# Altium schematic sheet Sheet1.SchDoc
size 558 x 330 mm
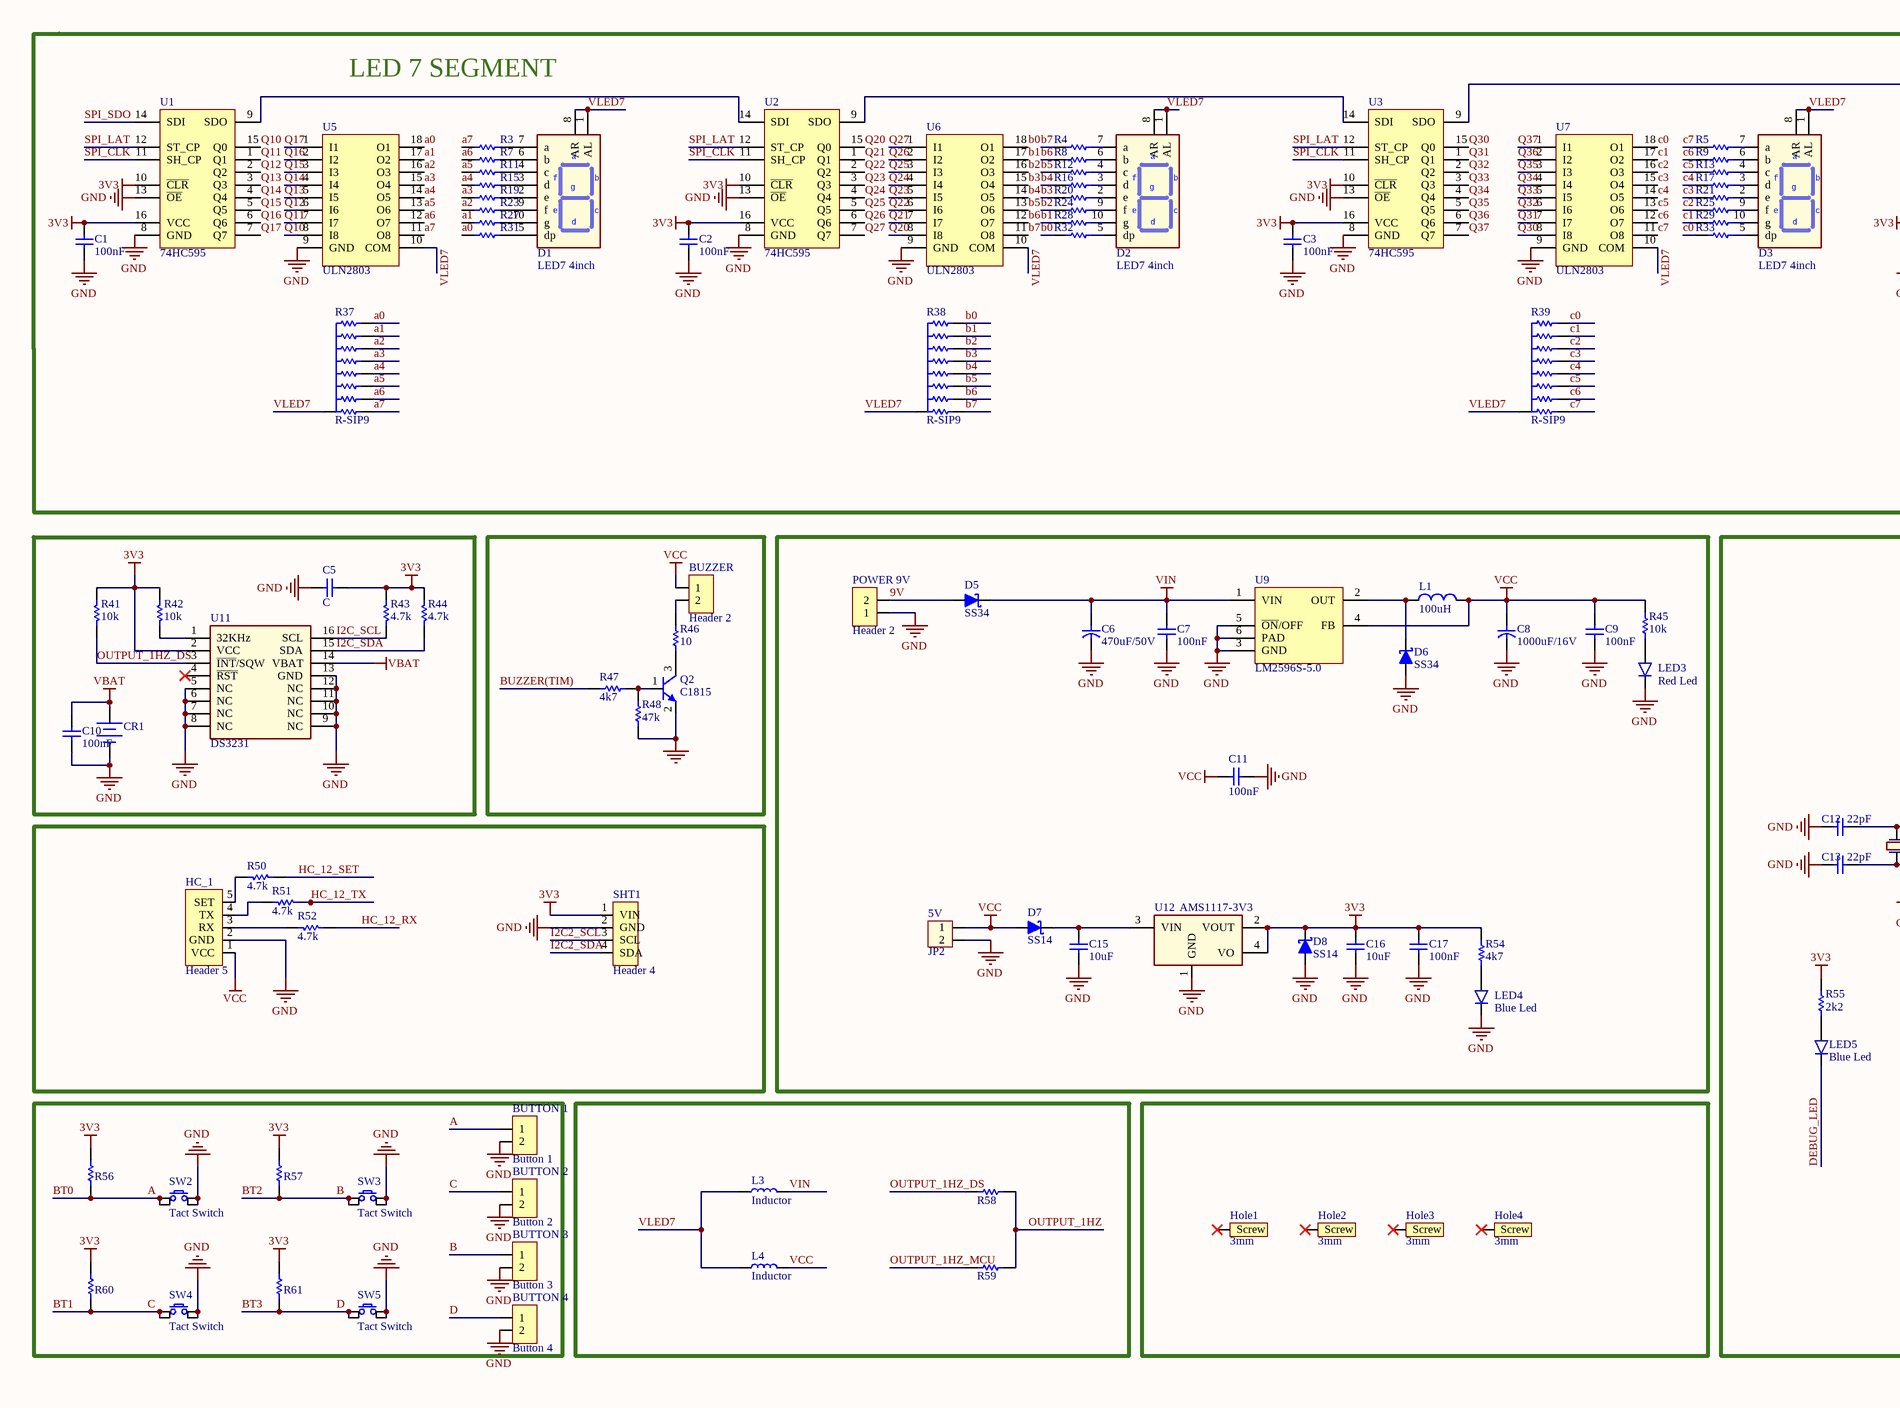
[diagram p0: Sheet1.SchDoc, left]
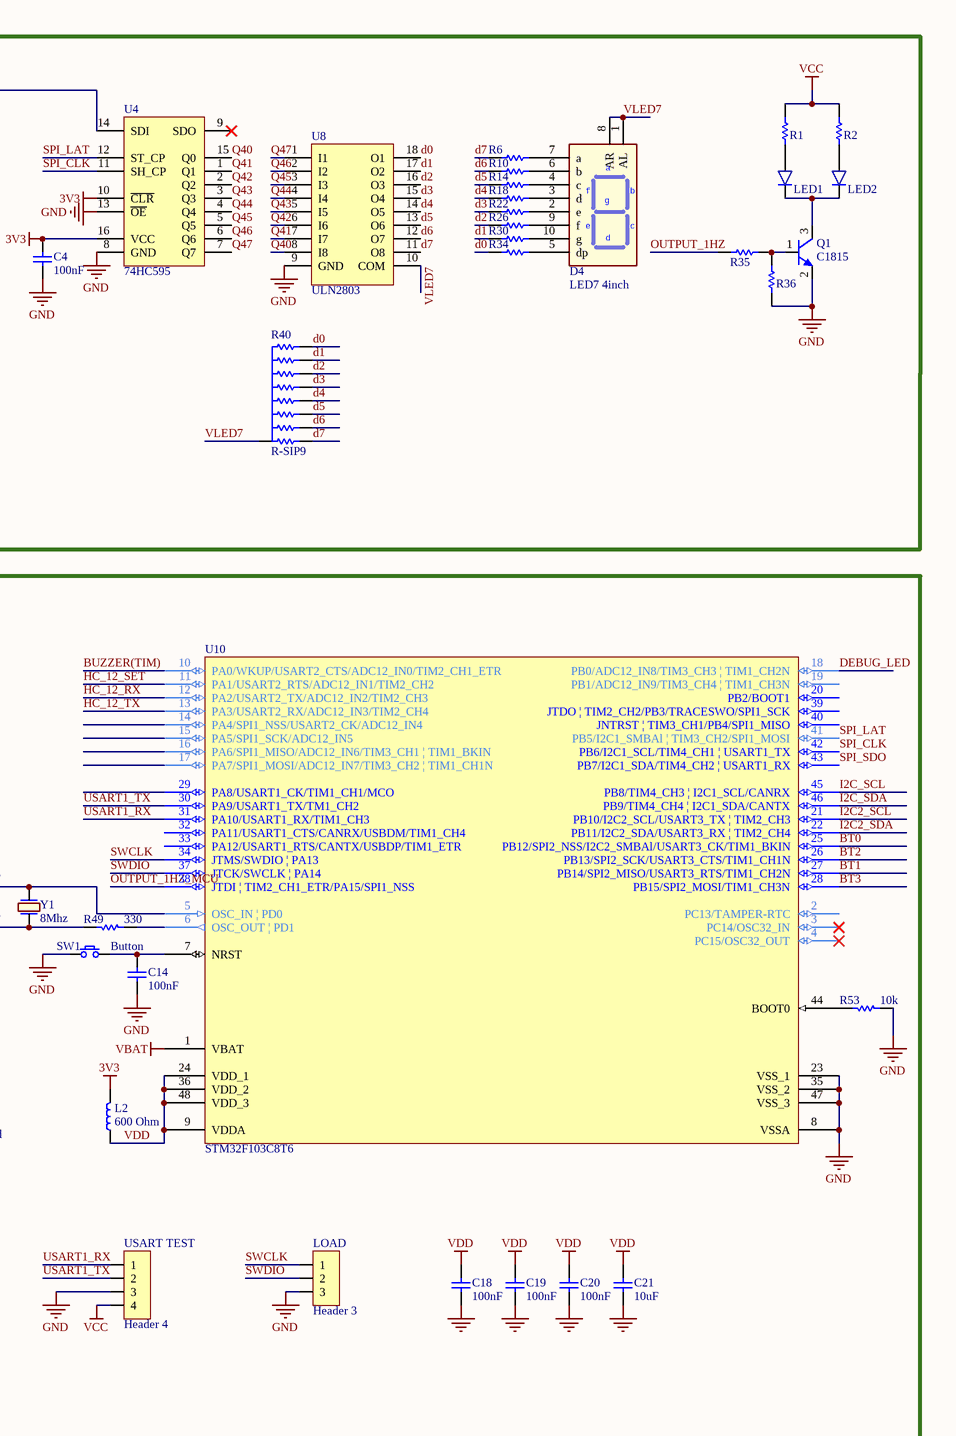
[diagram p1: Sheet1.SchDoc, right]

## Parts
5V  JP2  [CON Header 2]
BUTTON_1  Button 1  [CON Header 2]
BUTTON_2  Button 2  [CON Header 2]
BUTTON_3  Button 3  [CON Header 2]
BUTTON_4  Button 4  [CON Header 2]
BUZZER  Header 2  [CON Header 2]
C1  100nF  [C 0805 (2012)]
C2  100nF  [C 0805 (2012)]
C3  100nF  [C 0805 (2012)]
C4  100nF  [C 0805 (2012)]
C5  C  [C 0805 (2012)]
C6  470uF/50V  [CR/D.10.0x16.0/P.5.0]
C7  100nF  [C 0805 (2012)]
C8  1000uF/16V  [CR/D.10.0x12.5/P.5.0]
C9  100nF  [C 0805 (2012)]
C10  100nF  [C 0805 (2012)]
C11  100nF  [C 0805 (2012)]
C12  22pF  [C 0805 (2012)]
C13  22pF  [C 0805 (2012)]
C14  100nF  [C 0805 (2012)]
C15  10uF  [C 0805 (2012)]
C16  10uF  [C 0805 (2012)]
C17  100nF  [C 0805 (2012)]
C18  100nF  [C 0805 (2012)]
C19  100nF  [C 0805 (2012)]
C20  100nF  [C 0805 (2012)]
C21  10uF  [C 0805 (2012)]
CR1  (no value)  [CON CR1220]
D1  LED7 4inch  [LED7 4444]
D2  LED7 4inch  [LED7 4444]
D3  LED7 4inch  [LED7 4444]
D4  LED7 4inch  [LED7 4444]
D5  SS34  [DO-214AC (SMA)]
D6  SS34  [DO-214AC (SMA)]
D7  SS14  [DO-214AC (SMA)]
D8  SS14  [DO-214AC (SMA)]
HC_1  Header 5  [HC_12]
Hole1  3mm  [SCREW/3M/7M]
Hole2  3mm  [SCREW/3M/7M]
Hole3  3mm  [SCREW/3M/7M]
Hole4  3mm  [SCREW/3M/7M]
L1  100uH  [Inductor SMD 12x12x8]
L2  600 Ohm  [Inductor SMD 0805 (2012)]
L3  Inductor  [Inductor SMD 7.5x7.0x5.0]
L4  Inductor  [Inductor SMD 7.5x7.0x5.0]
LED1  Led  [LED 5MM]  (value not drawn)
LED2  Led  [LED 5MM]  (value not drawn)
LED3  Red Led  [Led SMD 0805]
LED4  Blue Led  [Led SMD 0805]
LED5  Blue Led  [Led SMD 0805]
LOAD  Header 3  [Header 3]
POWER_9V  Header 2  [CON Header 2]
Q1  C1815  [SOT-23]
Q2  C1815  [SOT-23]
R1  100Ohm  [R 0805 (2012)]  (value not drawn)
R2  100Ohm  [R 0805 (2012)]  (value not drawn)
R3  100Ohm  [R 0805 (2012)]  (value not drawn)
R4  100Ohm  [R 0805 (2012)]  (value not drawn)
R5  100Ohm  [R 0805 (2012)]  (value not drawn)
R6  100Ohm  [R 0805 (2012)]  (value not drawn)
R7  100Ohm  [R 0805 (2012)]  (value not drawn)
R8  100Ohm  [R 0805 (2012)]  (value not drawn)
R9  100Ohm  [R 0805 (2012)]  (value not drawn)
R10  100Ohm  [R 0805 (2012)]  (value not drawn)
R11  100Ohm  [R 0805 (2012)]  (value not drawn)
R12  100Ohm  [R 0805 (2012)]  (value not drawn)
R13  100Ohm  [R 0805 (2012)]  (value not drawn)
R14  100Ohm  [R 0805 (2012)]  (value not drawn)
R15  100Ohm  [R 0805 (2012)]  (value not drawn)
R16  100Ohm  [R 0805 (2012)]  (value not drawn)
R17  100Ohm  [R 0805 (2012)]  (value not drawn)
R18  100Ohm  [R 0805 (2012)]  (value not drawn)
R19  100Ohm  [R 0805 (2012)]  (value not drawn)
R20  100Ohm  [R 0805 (2012)]  (value not drawn)
R21  100Ohm  [R 0805 (2012)]  (value not drawn)
R22  100Ohm  [R 0805 (2012)]  (value not drawn)
R23  100Ohm  [R 0805 (2012)]  (value not drawn)
R24  100Ohm  [R 0805 (2012)]  (value not drawn)
R25  100Ohm  [R 0805 (2012)]  (value not drawn)
R26  100Ohm  [R 0805 (2012)]  (value not drawn)
R27  100Ohm  [R 0805 (2012)]  (value not drawn)
R28  100Ohm  [R 0805 (2012)]  (value not drawn)
R29  100Ohm  [R 0805 (2012)]  (value not drawn)
R30  100Ohm  [R 0805 (2012)]  (value not drawn)
R31  100Ohm  [R 0805 (2012)]  (value not drawn)
R32  100Ohm  [R 0805 (2012)]  (value not drawn)
R33  100Ohm  [R 0805 (2012)]  (value not drawn)
R34  100Ohm  [R 0805 (2012)]  (value not drawn)
R35  100Ohm  [R 0805 (2012)]  (value not drawn)
R36  100Ohm  [R 0805 (2012)]  (value not drawn)
R37  R-SIP9  [R SIP9]
R38  R-SIP9  [R SIP9]
R39  R-SIP9  [R SIP9]
R40  R-SIP9  [R SIP9]
R41  10k  [R 0805 (2012)]
R42  10k  [R 0805 (2012)]
R43  4.7k  [R 0805 (2012)]
R44  4.7k  [R 0805 (2012)]
R45  10k  [R 0805 (2012)]
R46  10  [R 0805 (2012)]
R47  4k7  [R 0805 (2012)]
R48  47k  [R 0805 (2012)]
R49  330  [R 0805 (2012)]
R50  4.7k  [R 0805 (2012)]
R51  4.7k  [R 0805 (2012)]
R52  4.7k  [R 0805 (2012)]
R53  10k  [R 0805 (2012)]
R54  4k7  [R 0805 (2012)]
R55  2k2  [R 0805 (2012)]
R56  100Ohm  [R 0805 (2012)]  (value not drawn)
R57  100Ohm  [R 0805 (2012)]  (value not drawn)
R58  100Ohm  [R 0805 (2012)]  (value not drawn)
R59  100Ohm  [R 0805 (2012)]  (value not drawn)
R60  100Ohm  [R 0805 (2012)]  (value not drawn)
R61  100Ohm  [R 0805 (2012)]  (value not drawn)
SHT1  Header 4  [CON Header 4]
SW1  Button  [SW/2/SMD]
SW2  Tact Switch  [SW/4/SMD/SMALL]
SW3  Tact Switch  [SW/4/SMD/SMALL]
SW4  Tact Switch  [SW/4/SMD/SMALL]
SW5  Tact Switch  [SW/4/SMD/SMALL]
U1  74HC595  [SOIC-16]
U2  74HC595  [SOIC-16]
U3  74HC595  [SOIC-16]
U4  74HC595  [SOIC-16]
U5  ULN2803  [SOIC-18]
U6  ULN2803  [SOIC-18]
U7  ULN2803  [SOIC-18]
U8  ULN2803  [SOIC-18]
U9  LM2596S-5.0  [TO-263-5]
U10  STM32F103C8T6  [LQFP48_N]
U11  DS3231  [SOIC-16-WIDE]
U12  AMS1117-3V3  [SOT-223]
USART_TEST  Header 4  [CON Header 4]
Y1  8Mhz  [Crystal HC49US SMD]

## Blocks framed on the sheet
LED 7 SEGMENT: C1-C4 D1-D4 LED1 LED2 Q1 R1-R40 U1-U8

## Nets
3V3: C1.1 C2.1 C3.1 C4.1 C5.2 C16.1 C17.1 D8.2(K) L2.2 R41.1 R42.1 R43.1 R44.1 R54.2 R55.2 R56.2 R57.2 R60.2 R61.2 SHT1.1(VIN) U1.10(~{CLR}) U1.16(VCC) U2.10(~{CLR}) U2.16(VCC) U3.10(~{CLR}) U3.16(VCC) U4.10(~{CLR}) U4.16(VCC) U11.2(VCC) U12.2(VOUT) U12.4(VO)
GND: 5V.2 BUTTON_1.2 BUTTON_2.2 BUTTON_3.2 BUTTON_4.2 C1.2 C2.2 C3.2 C4.2 C5.1 C6.2 C7.2 C8.2 C9.2 C10.2 C11.1 C12.2 C13.2 C14.2 C15.2 C16.2 C17.2 C18.2 C19.2 C20.2 C21.2 CR1.2(GND) D6.1(A) D8.1(A) HC_1.2(GND) LED3.2(K) LED4.2(K) LOAD.3 POWER_9V.1 Q1.2(E) Q2.2(E) R36.1 R48.2 R53.1 SHT1.2(GND) SW1.1 SW2.2 SW2.3 SW3.2 SW3.3 SW4.2 SW4.3 SW5.2 SW5.3 U1.8(GND) U1.13(~{OE}) U2.8(GND) U2.13(~{OE}) U3.8(GND) U3.13(~{OE}) U4.8(GND) U4.13(~{OE}) U5.9(GND) U6.9(GND) U7.9(GND) U8.9(GND) U9.3(GND) U9.5(~{ON}/OFF) U9.6(GND) U10.8(VSSA) U10.23(VSS_1) U10.35(VSS_2) U10.47(VSS_3) U11.5(NC) U11.6(NC) U11.7(NC) U11.8(NC) U11.9(NC) U11.10(NC) U11.11(NC) U11.12(NC) U11.13(GND) U12.1(GND) USART_TEST.3
VBAT: C10.1 CR1.1(VCC) U10.1(VBAT) U11.14(VBAT)
VCC: 5V.1 BUZZER.1 C8.1 C9.1 C11.2 D7.1(A) HC_1.1(VCC) L1.2 L4.2 R1.1 R2.1 R45.2 U9.4(FB) USART_TEST.4
VDD: C18.1 C19.1 C20.1 C21.1 L2.1 U10.9(VDDA) U10.24(VDD_1) U10.36(VDD_2) U10.48(VDD_3)
VIN: C6.1 C7.1 D5.2(K) L3.2 U9.1(VIN)
9V: D5.1(A) POWER_9V.2
A: BUTTON_1.1 R56.1 SW2.1 SW2.4 U10.25(PB12/SPI2_NSS/I2C2_SMBAl/USART3_CK/TIM1_BKIN)  [also labelled BT0]
a0: R31.1 R37.9 U5.18(O1)
a1: R27.1 R37.8 U5.17(O2)
a2: R23.1 R37.7 U5.16(O3)
a3: R19.1 R37.6 U5.15(O4)
a4: R15.1 R37.5 U5.14(O5)
a5: R11.1 R37.4 U5.13(O6)
a6: R7.1 R37.3 U5.12(O7)
a7: R3.1 R37.2 U5.11(O8)
B: BUTTON_3.1 R57.1 SW3.1 SW3.4 U10.26(PB13/SPI2_SCK/USART3_CTS/TIM1_CH1N)  [also labelled BT2]
b0: R32.1 R38.9 U6.18(O1)
b1: R28.1 R38.8 U6.17(O2)
b2: R24.1 R38.7 U6.16(O3)
b3: R20.1 R38.6 U6.15(O4)
b4: R16.1 R38.5 U6.14(O5)
b5: R12.1 R38.4 U6.13(O6)
b6: R8.1 R38.3 U6.12(O7)
b7: R4.1 R38.2 U6.11(O8)
BT1: BUTTON_2.1 R60.1 SW4.1 SW4.4 U10.27(PB14/SPI2_MISO/USART3_RTS/TIM1_CH2N)  [also labelled C]
BT3: BUTTON_4.1 R61.1 SW5.1 SW5.4 U10.28(PB15/SPI2_MOSI/TIM1_CH3N)  [also labelled D]
BUZZER(TIM): R47.2 U10.10(PA0/WKUP/USART2_CTS/ADC12_IN0/TIM2_CH1_ETR)
c0: R33.1 R39.9 U7.18(O1)
c1: R29.1 R39.8 U7.17(O2)
c2: R25.1 R39.7 U7.16(O3)
c3: R21.1 R39.6 U7.15(O4)
c4: R17.1 R39.5 U7.14(O5)
c5: R13.1 R39.4 U7.13(O6)
c6: R9.1 R39.3 U7.12(O7)
c7: R5.1 R39.2 U7.11(O8)
d0: R34.1 R40.9 U8.18(O1)
d1: R30.1 R40.8 U8.17(O2)
d2: R26.1 R40.7 U8.16(O3)
d3: R22.1 R40.6 U8.15(O4)
d4: R18.1 R40.5 U8.14(O5)
d5: R14.1 R40.4 U8.13(O6)
d6: R10.1 R40.3 U8.12(O7)
d7: R6.1 R40.2 U8.11(O8)
DEBUG_LED: LED5.2(K) U10.18(PB0/ADC12_IN8/TIM3_CH3_|_TIM1_CH2N)
HC_12_RX: R52.2 U10.12(PA2/USART2_TX/ADC12_IN2/TIM2_CH3)
HC_12_SET: R50.2 U10.11(PA1/USART2_RTS/ADC12_IN1/TIM2_CH2)
HC_12_TX: R51.2 U10.13(PA3/USART2_RX/ADC12_IN3/TIM2_CH4)
I2C2_SCL: SHT1.3(SCL) U10.21(PB10/I2C2_SCL/USART3_TX_|_TIM2_CH3)
I2C2_SDA: SHT1.4(SDA) U10.22(PB11/I2C2_SDA/USART3_RX_|_TIM2_CH4)
I2C_SCL: R43.2 U10.45(PB8/TIM4_CH3_|_I2C1_SCL/CANRX) U11.16(SCL)
I2C_SDA: R44.2 U10.46(PB9/TIM4_CH4_|_I2C1_SDA/CANTX) U11.15(SDA)
OUTPUT_1HZ: R35.1 R58.1 R59.1
OUTPUT_1HZ_DS: R41.2 R58.2 U11.3(~{INT}/SQW)
OUTPUT_1HZ_MCU: R59.2 U10.38(JTDI_|_TIM2_CH1_ETR/PA15/SPI1_NSS)
Q10: U1.15(Q0) U5.8(I8)
Q11: U1.1(Q1) U5.7(I7)
Q12: U1.2(Q2) U5.6(I6)
Q13: U1.3(Q3) U5.5(I5)
Q14: U1.4(Q4) U5.4(I4)
Q15: U1.5(Q5) U5.3(I3)
Q16: U1.6(Q6) U5.2(I2)
Q17: U1.7(Q7) U5.1(I1)
Q20: U2.15(Q0) U6.8(I8)
Q21: U2.1(Q1) U6.7(I7)
Q22: U2.2(Q2) U6.6(I6)
Q23: U2.3(Q3) U6.5(I5)
Q24: U2.4(Q4) U6.4(I4)
Q25: U2.5(Q5) U6.3(I3)
Q26: U2.6(Q6) U6.2(I2)
Q27: U2.7(Q7) U6.1(I1)
Q30: U3.15(Q0) U7.8(I8)
Q31: U3.1(Q1) U7.7(I7)
Q32: U3.2(Q2) U7.6(I6)
Q33: U3.3(Q3) U7.5(I5)
Q34: U3.4(Q4) U7.4(I4)
Q35: U3.5(Q5) U7.3(I3)
Q36: U3.6(Q6) U7.2(I2)
Q37: U3.7(Q7) U7.1(I1)
Q40: U4.15(Q0) U8.8(I8)
Q41: U4.1(Q1) U8.7(I7)
Q42: U4.2(Q2) U8.6(I6)
Q43: U4.3(Q3) U8.5(I5)
Q44: U4.4(Q4) U8.4(I4)
Q45: U4.5(Q5) U8.3(I3)
Q46: U4.6(Q6) U8.2(I2)
Q47: U4.7(Q7) U8.1(I1)
SPI_CLK: U1.11(SH_CP) U2.11(SH_CP) U3.11(SH_CP) U4.11(SH_CP) U10.42(PB6/I2C1_SCL/TIM4_CH1_|_USART1_TX)
SPI_LAT: U1.12(ST_CP) U2.12(ST_CP) U3.12(ST_CP) U4.12(ST_CP) U10.41(PB5/I2C1_SMBAl_|_TIM3_CH2/SPI1_MOSI)
SPI_SDO: U1.14(SDI) U10.43(PB7/I2C1_SDA/TIM4_CH2_|_USART1_RX)
SWCLK: LOAD.1 U10.34(JTMS/SWDIO_|_PA13)
SWDIO: LOAD.2 U10.37(JTCK/SWCLK_|_PA14)
USART1_RX: U10.31(PA10/USART1_RX/TIM1_CH3) USART_TEST.1
USART1_TX: U10.30(PA9/USART1_TX/TM1_CH2) USART_TEST.2
VLED7: D1.1(AL) D1.8(AR) D2.1(AL) D2.8(AR) D3.1(AL) D3.8(AR) D4.1(AL) D4.8(AR) L3.1 L4.1 R37.1 R38.1 R39.1 R40.1 U5.10(COM) U6.10(COM) U7.10(COM) U8.10(COM)
NetBUZZER_2: BUZZER.2 R46.2
NetC12_1: C12.1 U10.5(OSC_IN_|_PD0) Y1.2
NetC13_1: C13.1 R49.2 Y1.1
NetC14_1: C14.1 SW1.2 U10.7(NRST)
NetC15_1: C15.1 D7.2(K) U12.3(VIN)
NetD1_2: D1.2(e) R19.2
NetD1_3: D1.3(d) R15.2
NetD1_4: D1.4(c) R11.2
NetD1_5: D1.5(dp) R31.2
NetD1_6: D1.6(b) R7.2
NetD1_7: D1.7(a) R3.2
NetD1_9: D1.9(f) R23.2
NetD1_10: D1.10(g) R27.2
NetD2_2: D2.2(e) R20.2
NetD2_3: D2.3(d) R16.2
NetD2_4: D2.4(c) R12.2
NetD2_5: D2.5(dp) R32.2
NetD2_6: D2.6(b) R8.2
NetD2_7: D2.7(a) R4.2
NetD2_9: D2.9(f) R24.2
NetD2_10: D2.10(g) R28.2
NetD3_2: D3.2(e) R21.2
NetD3_3: D3.3(d) R17.2
NetD3_4: D3.4(c) R13.2
NetD3_5: D3.5(dp) R33.2
NetD3_6: D3.6(b) R9.2
NetD3_7: D3.7(a) R5.2
NetD3_9: D3.9(f) R25.2
NetD3_10: D3.10(g) R29.2
NetD4_2: D4.2(e) R22.2
NetD4_3: D4.3(d) R18.2
NetD4_4: D4.4(c) R14.2
NetD4_5: D4.5(dp) R34.2
NetD4_6: D4.6(b) R10.2
NetD4_7: D4.7(a) R6.2
NetD4_9: D4.9(f) R26.2
NetD4_10: D4.10(g) R30.2
NetD6_2: D6.2(K) L1.1 U9.2(OUT)
NetHC_1_3: HC_1.3(RX) R52.1
NetHC_1_4: HC_1.4(TX) R51.1
NetHC_1_5: HC_1.5(SET) R50.1
NetLED1_1: LED1.1(A) R1.2
NetLED1_2: LED1.2(K) LED2.2(K) Q1.3(C)
NetLED2_1: LED2.1(A) R2.2
NetLED3_1: LED3.1(A) R45.1
NetLED4_1: LED4.1(A) R54.1
NetLED5_1: LED5.1(A) R55.1
NetQ1_1: Q1.1(B) R35.2 R36.2
NetQ2_1: Q2.1(B) R47.1 R48.1
NetQ2_3: Q2.3(C) R46.1
NetR42_2: R42.2 U11.1(32KHz)
NetR49_1: R49.1 U10.6(OSC_OUT_|_PD1)
NetR53_2: R53.2 U10.44(BOOT0)
NetU1_9: U1.9(SDO) U2.14(SDI)
NetU2_9: U2.9(SDO) U3.14(SDI)
NetU3_9: U3.9(SDO) U4.14(SDI)

Not connected (* = marked no-connect by the designer): Hole1 1(Screw)*; Hole2 1(Screw)*; Hole3 1(Screw)*; Hole4 1(Screw)*; U4 9(SDO)*; U10 2(PC13/TAMPER-RTC) 3(PC14/OSC32_IN)* 4(PC15/OSC32_OUT)* 14(PA4/SPI1_NSS/USART2_CK/ADC12_IN4) 15(PA5/SPI1_SCK/ADC12_IN5) 16(PA6/SPI1_MISO/ADC12_IN6/TIM3_CH1_|_TIM1_BKIN) 17(PA7/SPI1_MOSI/ADC12_IN7/TIM3_CH2_|_TIM1_CH1N) 19(PB1/ADC12_IN9/TIM3_CH4_|_TIM1_CH3N) 20(PB2/BOOT1) 29(PA8/USART1_CK/TIM1_CH1/MCO) 32(PA11/USART1_CTS/CANRX/USBDM/TIM1_CH4) 33(PA12/USART1_RTS/CANTX/USBDP/TIM1_ETR) 39(JTDO_|_TIM2_CH2/PB3/TRACESWO/SPI1_SCK) 40(JNTRST_|_TIM3_CH1/PB4/SPI1_MISO); U11 4(~{RST})*

## Library data of the parts
5V = Con2: Connector 2; Value: Connector 2
BUTTON_1-BUTTON_4 BUZZER POWER_9V = Header 2: Header, 2-Pin; LatestRevisionDate: 17-Jul-2002; LatestRevisionNote: Re-released for DXP Platform.; Publisher: Altium Limited
C1-C5 C7 C9-C21 = Capacitor NP: Capacitor non-pol
C6 C8 = Capacitor: Capacitor pol
CR1 = Battery
D5-D8 = Diode Schottky: Schottky Diode; Published: 8-Jun-2000; LatestRevisionDate: 17-Jul-2002; LatestRevisionNote: Re-released for DXP Platform.; PackageReference: SMB; Publisher: Altium Limited; Code_JEDEC: DO-214-AA
HC_1 = HC_12: Header, 5-Pin; LatestRevisionDate: 17-Jul-2002; LatestRevisionNote: Re-released for DXP Platform.; Publisher: Altium Limited
Hole1-Hole4 = Screw
L1 = L1: Inductor; Value: 150 mH
L2 = Inductor
LED1-LED5 = Led: Typical LED
LOAD = Header 3: Header, 3-Pin
Q1 Q2 = Transistor NPN: NPN Bipolar Transistor
R1-R36 R41-R61 = Resistor: Published: 8-Jun-2000; LatestRevisionDate: 17-Jul-2002; LatestRevisionNote: Re-released for DXP Platform.; PackageReference: AXIAL-0.3; Publisher: Altium Limited
R37-R40 = Resistor Sip9: Resistor; Published: 8-Jun-2000; LatestRevisionDate: 17-Jul-2002; LatestRevisionNote: Re-released for DXP Platform.; PackageReference: AXIAL-0.3; Publisher: Altium Limited
SHT1 USART_TEST = Header 4: Header, 4-Pin
SW1 = SW SPST: Tact switch 2 pin
SW2-SW5 = SW SPST-4: Tact switch 4 pin
U1-U4 = 74HC595: 8-bit serial-in, serial or parallel-out  shift register with output latches;  3-state
U5-U8 = ULN2803: High-voltage, high-current Darlington transistor arrays
U9 = LM2576/96: SIMPLE SWITCHER® 3A Step-Down Voltage Regulator
U10 = STM32F103C8T6: STM32 ARM-based 32-bit MCU with 64 Kbytes Flash, 48-pin LQFP, Industrial Temperature; Published: 30-May-2008; DatasheetVersion: rev6, Mar-2008; PackageVersion: Mar-2008; PackageReference: LQFP48; Publisher: Altium Limited; PackageDescription: 48-Pin Low-Profile Quad Flat Pack, 7 x 7 mm Body, 0.5 mm Pitch (LQFP48); ComponentLink1Description: Manufacturer Link; ComponentLink1URL: www.st.com/stm32; ComponentLink2Description: Datasheet; ComponentLink2URL: http://www.st.com/stonline/products/literature/ds/13587.pdf
U12 = AMS1117: 1A LDO Voltage Regulator, ADJ or fixed 1.5/1.8/2.5/2.85/3.3/5V
Y1 = Crystal